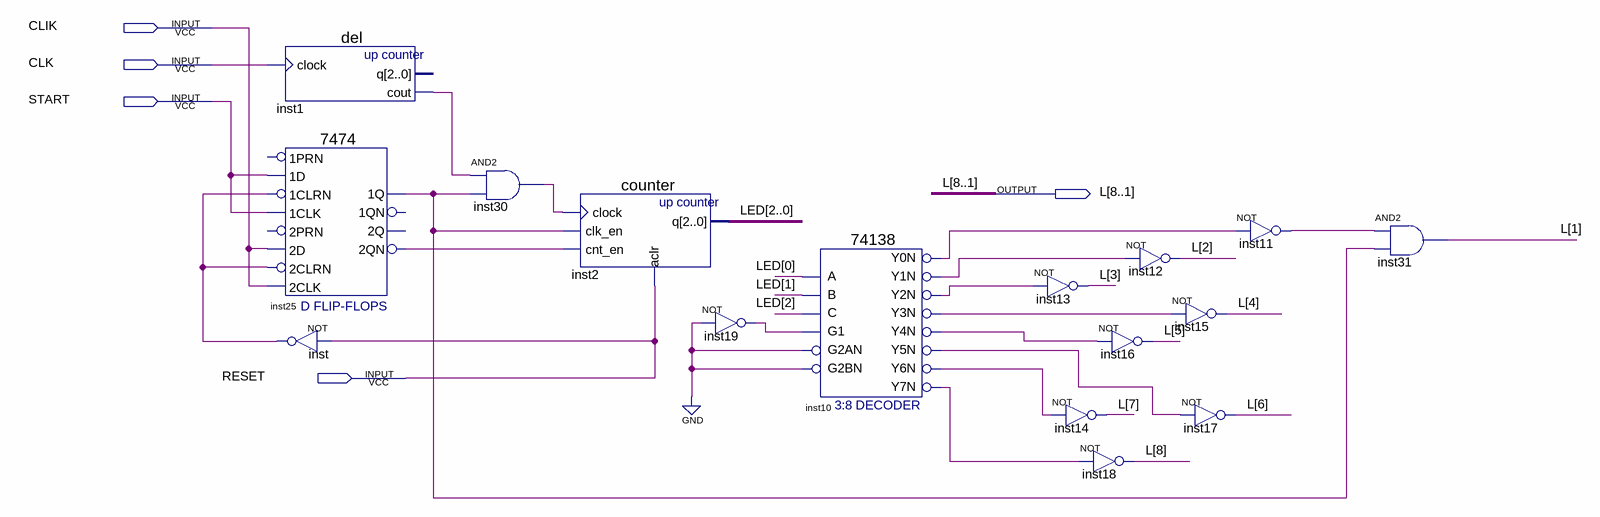
[diagram p0: schematic sheet]
// Quartus schematic starfall.bdf as structural Verilog: 16 symbols, 5 pins
module starfall (
  input  CLIK,
  input  CLK,
  input  START,
  input  RESET,
  output [8:1] L
);

  wire inst1_cout, inst10_y0n, inst10_y1n, inst10_y2n, inst10_y3n, inst10_y4n, inst10_y5n, inst10_y6n,
       inst10_y7n, inst11_out, inst19_out, inst25_1q, inst25_2qn, inst30_out, inst_out;
  wire [2:0] LED;

  del inst1 (.clock(CLK), .cout(inst1_cout));  // open: q
  \7474  inst25 (
    .\2D (CLIK), .\1CLK (START), .\1D (START), .\2CLK (CLIK), .\2CLRN (inst_out), .\1CLRN (inst_out),
    .\2QN (inst25_2qn), .\1Q (inst25_1q));  // open: 2PRN, 1PRN, 1QN, 2Q
  not inst (inst_out, RESET);
  and inst30 (inst30_out, inst1_cout, inst25_1q);
  counter inst2 (.clock(inst30_out), .clk_en(inst25_1q), .cnt_en(inst25_2qn), .aclr(RESET), .q(LED));
  not inst19 (inst19_out, 1'b0);
  \74138  inst10 (
    .A(LED[0]), .B(LED[1]), .G1(inst19_out), .C(LED[2]), .G2AN(1'b0), .G2BN(1'b0), .Y0N(inst10_y0n),
    .Y1N(inst10_y1n), .Y2N(inst10_y2n), .Y3N(inst10_y3n), .Y4N(inst10_y4n), .Y5N(inst10_y5n),
    .Y6N(inst10_y6n), .Y7N(inst10_y7n));
  not inst13 (L[3], inst10_y2n);
  not inst14 (L[7], inst10_y6n);
  not inst18 (L[8], inst10_y7n);
  not inst12 (L[2], inst10_y1n);
  not inst16 (L[5], inst10_y4n);
  not inst11 (inst11_out, inst10_y0n);
  not inst15 (L[4], inst10_y3n);
  not inst17 (L[6], inst10_y5n);
  and inst31 (L[1], inst11_out, inst25_1q);
endmodule
